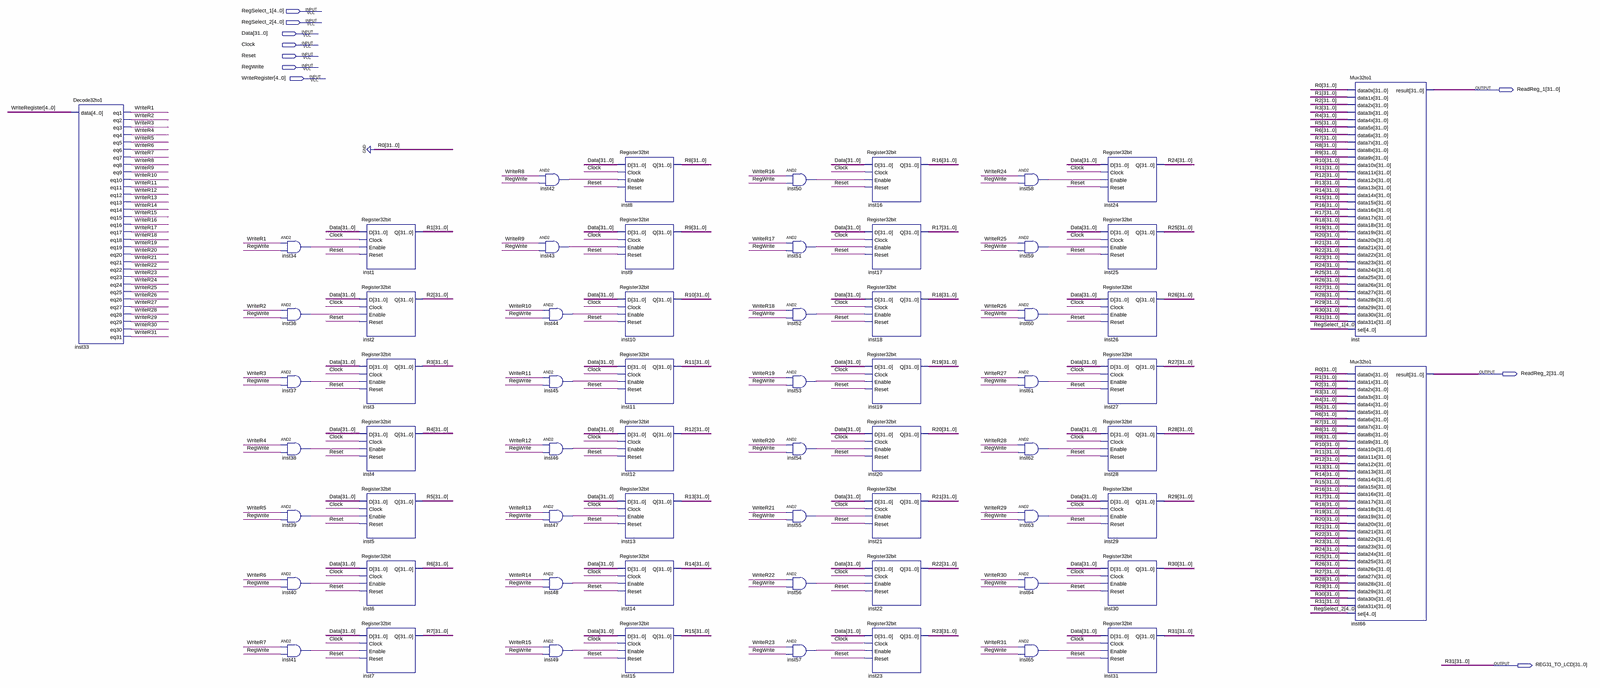
[diagram p0: schematic sheet, whole]
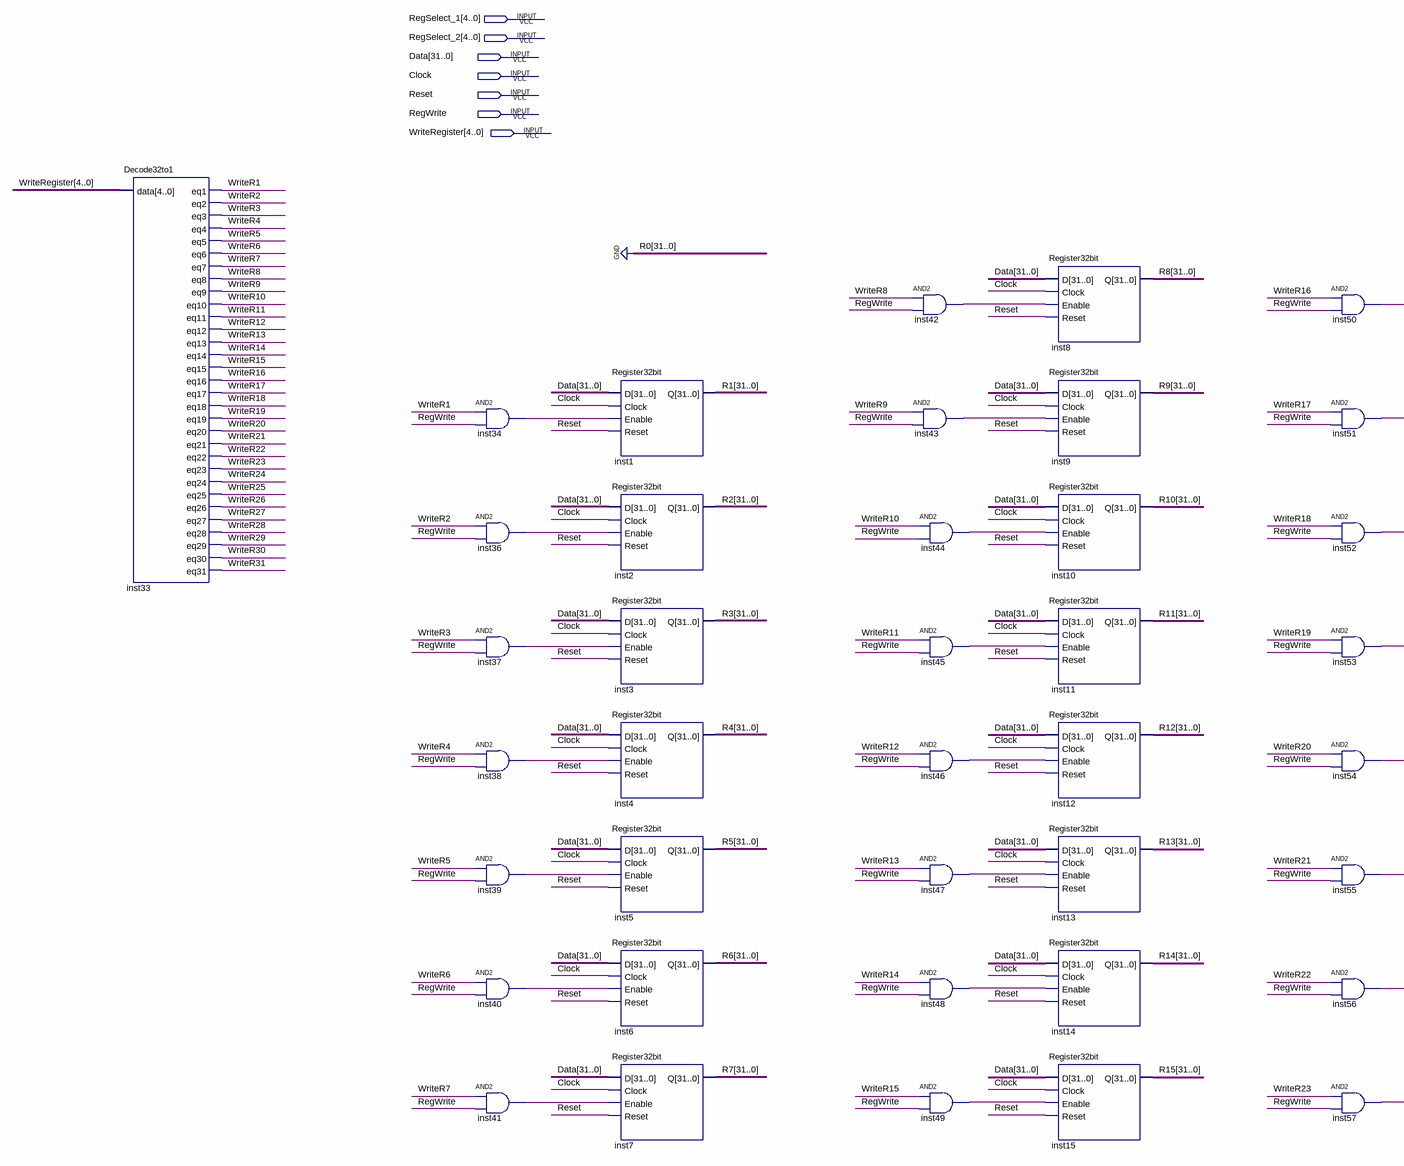
[diagram p1: schematic sheet, left part]
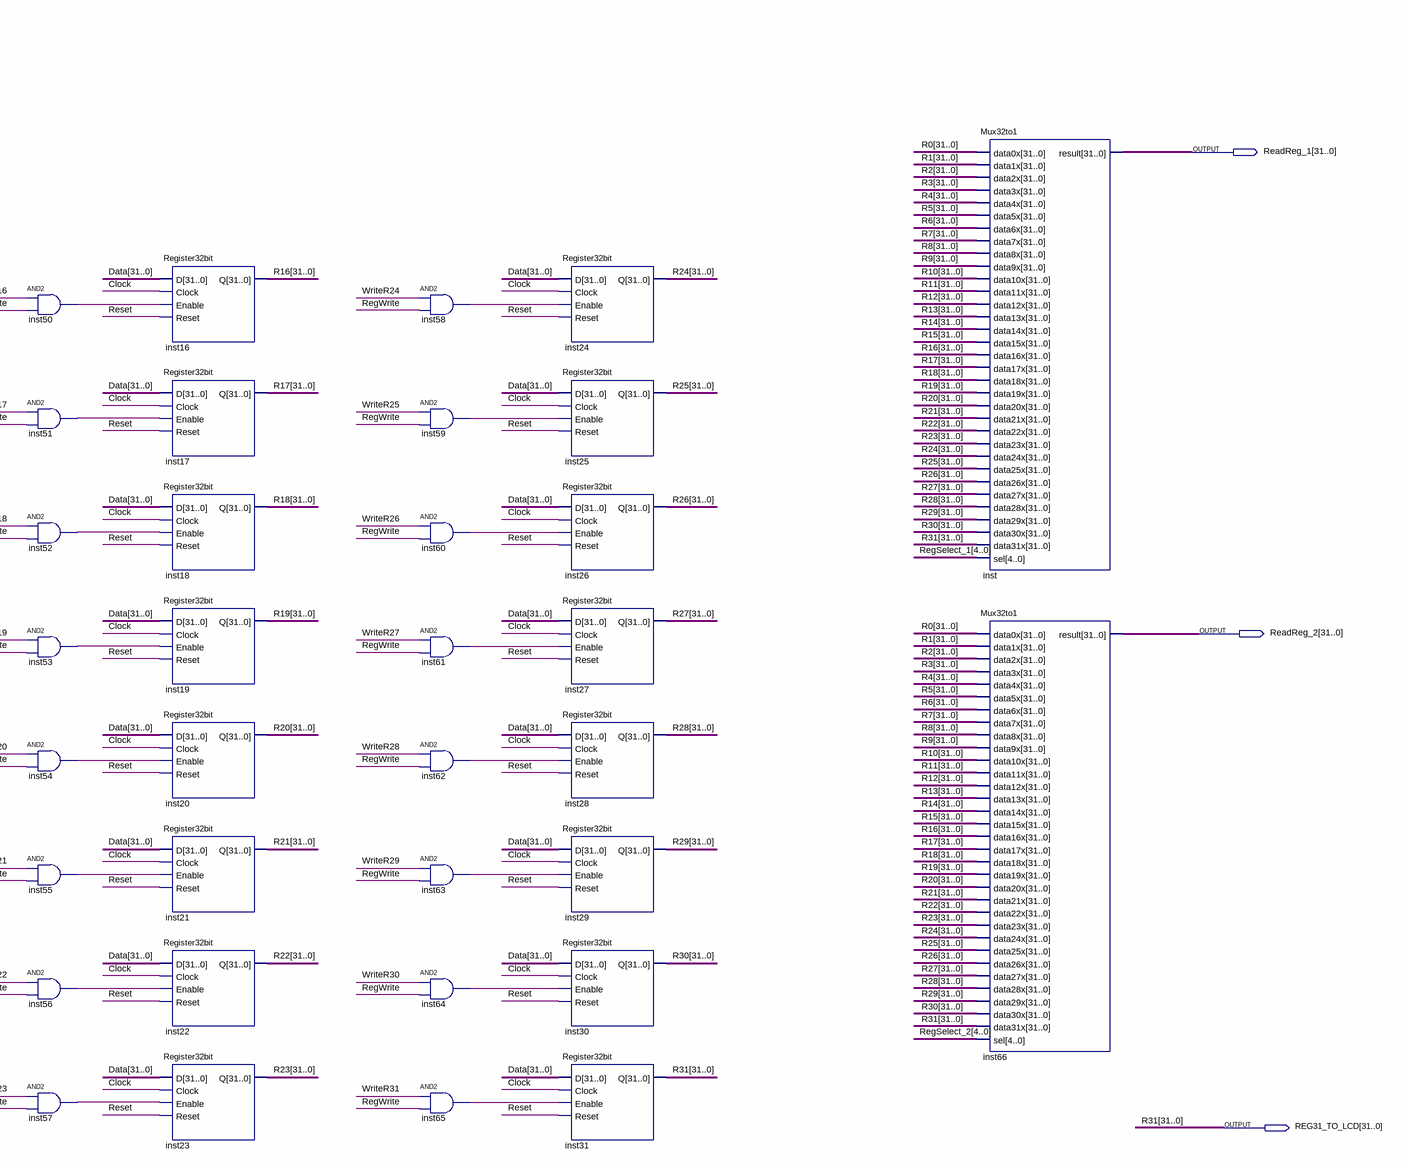
[diagram p2: schematic sheet, right part]
// Quartus schematic RegisterFile.bdf as structural Verilog: 65 symbols, 10 pins
module RegisterFile (
  input  [4:0] RegSelect_1,
  input  [4:0] RegSelect_2,
  input  [31:0] Data,
  input  Clock,
  input  Reset,
  input  RegWrite,
  input  [4:0] WriteRegister,
  output [31:0] ReadReg_1,
  output [31:0] ReadReg_2,
  output [31:0] REG31_TO_LCD
);

  wire inst34_out, inst36_out, inst37_out, inst38_out, inst39_out, inst40_out, inst41_out, inst42_out,
       inst43_out, inst44_out, inst45_out, inst46_out, inst47_out, inst48_out, inst49_out, inst50_out,
       inst51_out, inst52_out, inst53_out, inst54_out, inst55_out, inst56_out, inst57_out, inst58_out,
       inst59_out, inst60_out, inst61_out, inst62_out, inst63_out, inst64_out, inst65_out, WriteR1, WriteR2,
       WriteR3, WriteR4, WriteR5, WriteR6, WriteR7, WriteR8, WriteR9, WriteR10, WriteR11, WriteR12, WriteR13,
       WriteR14, WriteR15, WriteR16, WriteR17, WriteR18, WriteR19, WriteR20, WriteR21, WriteR22, WriteR23,
       WriteR24, WriteR25, WriteR26, WriteR27, WriteR28, WriteR29, WriteR30, WriteR31;
  wire [31:0] R1, R2, R3, R4, R5, R6, R7, R8, R9, R10, R11, R12, R13, R14, R15, R16, R17, R18, R19, R20, R21,
       R22, R23, R24, R25, R26, R27, R28, R29, R30;

  Decode32to1 inst33 (
    .data(WriteRegister), .eq1(WriteR1), .eq2(WriteR2), .eq3(WriteR3), .eq4(WriteR4), .eq5(WriteR5),
    .eq6(WriteR6), .eq7(WriteR7), .eq8(WriteR8), .eq9(WriteR9), .eq10(WriteR10), .eq11(WriteR11),
    .eq12(WriteR12), .eq13(WriteR13), .eq14(WriteR14), .eq15(WriteR15), .eq16(WriteR16), .eq17(WriteR17),
    .eq18(WriteR18), .eq19(WriteR19), .eq20(WriteR20), .eq21(WriteR21), .eq22(WriteR22), .eq23(WriteR23),
    .eq24(WriteR24), .eq25(WriteR25), .eq26(WriteR26), .eq27(WriteR27), .eq28(WriteR28), .eq29(WriteR29),
    .eq30(WriteR30), .eq31(WriteR31));
  and inst34 (inst34_out, WriteR1, RegWrite);
  and inst36 (inst36_out, WriteR2, RegWrite);
  and inst37 (inst37_out, WriteR3, RegWrite);
  and inst38 (inst38_out, WriteR4, RegWrite);
  and inst39 (inst39_out, WriteR5, RegWrite);
  and inst40 (inst40_out, WriteR6, RegWrite);
  and inst41 (inst41_out, WriteR7, RegWrite);
  Register32bit inst1 (.D(Data), .Clock(Clock), .Enable(inst34_out), .Reset(Reset), .Q(R1));
  Register32bit inst2 (.D(Data), .Clock(Clock), .Enable(inst36_out), .Reset(Reset), .Q(R2));
  Register32bit inst3 (.D(Data), .Clock(Clock), .Enable(inst37_out), .Reset(Reset), .Q(R3));
  Register32bit inst4 (.D(Data), .Clock(Clock), .Enable(inst38_out), .Reset(Reset), .Q(R4));
  Register32bit inst5 (.D(Data), .Clock(Clock), .Enable(inst39_out), .Reset(Reset), .Q(R5));
  Register32bit inst6 (.D(Data), .Clock(Clock), .Enable(inst40_out), .Reset(Reset), .Q(R6));
  Register32bit inst7 (.D(Data), .Clock(Clock), .Enable(inst41_out), .Reset(Reset), .Q(R7));
  and inst42 (inst42_out, WriteR8, RegWrite);
  and inst43 (inst43_out, WriteR9, RegWrite);
  and inst44 (inst44_out, WriteR10, RegWrite);
  and inst45 (inst45_out, WriteR11, RegWrite);
  and inst46 (inst46_out, WriteR12, RegWrite);
  and inst47 (inst47_out, WriteR13, RegWrite);
  and inst48 (inst48_out, WriteR14, RegWrite);
  and inst49 (inst49_out, WriteR15, RegWrite);
  Register32bit inst8 (.D(Data), .Clock(Clock), .Enable(inst42_out), .Reset(Reset), .Q(R8));
  Register32bit inst9 (.D(Data), .Clock(Clock), .Enable(inst43_out), .Reset(Reset), .Q(R9));
  Register32bit inst10 (.D(Data), .Clock(Clock), .Enable(inst44_out), .Reset(Reset), .Q(R10));
  Register32bit inst11 (.D(Data), .Clock(Clock), .Enable(inst45_out), .Reset(Reset), .Q(R11));
  Register32bit inst12 (.D(Data), .Clock(Clock), .Enable(inst46_out), .Reset(Reset), .Q(R12));
  Register32bit inst13 (.D(Data), .Clock(Clock), .Enable(inst47_out), .Reset(Reset), .Q(R13));
  Register32bit inst14 (.D(Data), .Clock(Clock), .Enable(inst48_out), .Reset(Reset), .Q(R14));
  Register32bit inst15 (.D(Data), .Clock(Clock), .Enable(inst49_out), .Reset(Reset), .Q(R15));
  and inst50 (inst50_out, WriteR16, RegWrite);
  and inst51 (inst51_out, WriteR17, RegWrite);
  and inst52 (inst52_out, WriteR18, RegWrite);
  and inst53 (inst53_out, WriteR19, RegWrite);
  and inst54 (inst54_out, WriteR20, RegWrite);
  and inst55 (inst55_out, WriteR21, RegWrite);
  and inst56 (inst56_out, WriteR22, RegWrite);
  and inst57 (inst57_out, WriteR23, RegWrite);
  Register32bit inst16 (.D(Data), .Clock(Clock), .Enable(inst50_out), .Reset(Reset), .Q(R16));
  Register32bit inst17 (.D(Data), .Clock(Clock), .Enable(inst51_out), .Reset(Reset), .Q(R17));
  Register32bit inst18 (.D(Data), .Clock(Clock), .Enable(inst52_out), .Reset(Reset), .Q(R18));
  Register32bit inst19 (.D(Data), .Clock(Clock), .Enable(inst53_out), .Reset(Reset), .Q(R19));
  Register32bit inst20 (.D(Data), .Clock(Clock), .Enable(inst54_out), .Reset(Reset), .Q(R20));
  Register32bit inst21 (.D(Data), .Clock(Clock), .Enable(inst55_out), .Reset(Reset), .Q(R21));
  Register32bit inst22 (.D(Data), .Clock(Clock), .Enable(inst56_out), .Reset(Reset), .Q(R22));
  Register32bit inst23 (.D(Data), .Clock(Clock), .Enable(inst57_out), .Reset(Reset), .Q(R23));
  and inst58 (inst58_out, WriteR24, RegWrite);
  and inst59 (inst59_out, WriteR25, RegWrite);
  and inst60 (inst60_out, WriteR26, RegWrite);
  and inst61 (inst61_out, WriteR27, RegWrite);
  and inst62 (inst62_out, WriteR28, RegWrite);
  and inst63 (inst63_out, WriteR29, RegWrite);
  and inst64 (inst64_out, WriteR30, RegWrite);
  and inst65 (inst65_out, WriteR31, RegWrite);
  Register32bit inst24 (.D(Data), .Clock(Clock), .Enable(inst58_out), .Reset(Reset), .Q(R24));
  Register32bit inst25 (.D(Data), .Clock(Clock), .Enable(inst59_out), .Reset(Reset), .Q(R25));
  Register32bit inst26 (.D(Data), .Clock(Clock), .Enable(inst60_out), .Reset(Reset), .Q(R26));
  Register32bit inst27 (.D(Data), .Clock(Clock), .Enable(inst61_out), .Reset(Reset), .Q(R27));
  Register32bit inst28 (.D(Data), .Clock(Clock), .Enable(inst62_out), .Reset(Reset), .Q(R28));
  Register32bit inst29 (.D(Data), .Clock(Clock), .Enable(inst63_out), .Reset(Reset), .Q(R29));
  Register32bit inst30 (.D(Data), .Clock(Clock), .Enable(inst64_out), .Reset(Reset), .Q(R30));
  Register32bit inst31 (.D(Data), .Clock(Clock), .Enable(inst65_out), .Reset(Reset), .Q(REG31_TO_LCD));
  Mux32to1 inst (
    .data0x({32{1'b0}}), .data1x(R1), .data2x(R2), .data3x(R3), .data4x(R4), .data5x(R5), .data6x(R6),
    .data7x(R7), .data8x(R8), .data9x(R9), .data10x(R10), .data11x(R11), .data12x(R12), .data13x(R13),
    .data14x(R14), .data15x(R15), .data16x(R16), .data17x(R17), .data18x(R18), .data19x(R19), .data20x(R20),
    .data21x(R21), .data22x(R22), .data23x(R23), .data24x(R24), .data25x(R25), .data26x(R26), .data27x(R27),
    .data28x(R28), .data29x(R29), .data30x(R30), .data31x(REG31_TO_LCD), .sel(RegSelect_1), .result(ReadReg_1));
  Mux32to1 inst66 (
    .data0x({32{1'b0}}), .data1x(R1), .data2x(R2), .data3x(R3), .data4x(R4), .data5x(R5), .data6x(R6),
    .data7x(R7), .data8x(R8), .data9x(R9), .data10x(R10), .data11x(R11), .data12x(R12), .data13x(R13),
    .data14x(R14), .data15x(R15), .data16x(R16), .data17x(R17), .data18x(R18), .data19x(R19), .data20x(R20),
    .data21x(R21), .data22x(R22), .data23x(R23), .data24x(R24), .data25x(R25), .data26x(R26), .data27x(R27),
    .data28x(R28), .data29x(R29), .data30x(R30), .data31x(REG31_TO_LCD), .sel(RegSelect_2), .result(ReadReg_2));

  // Other names for the same wires on the sheet: R31[31:0] = REG31_TO_LCD
endmodule
